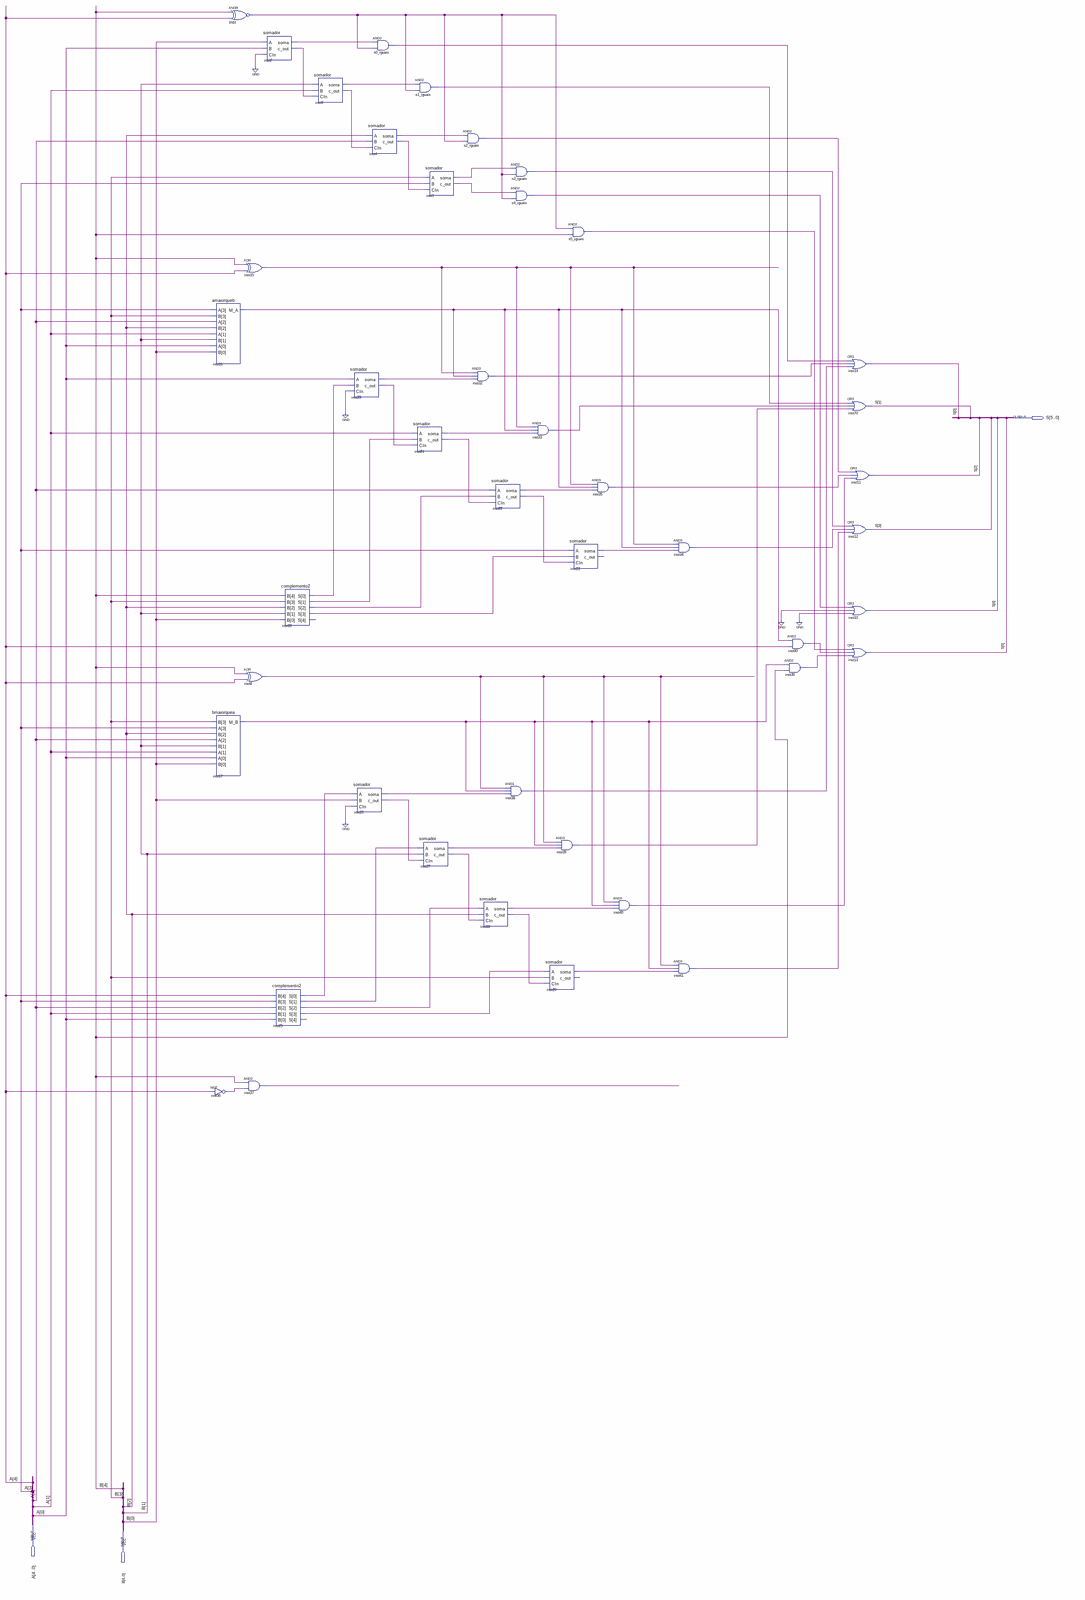
[diagram p0: schematic sheet, whole]
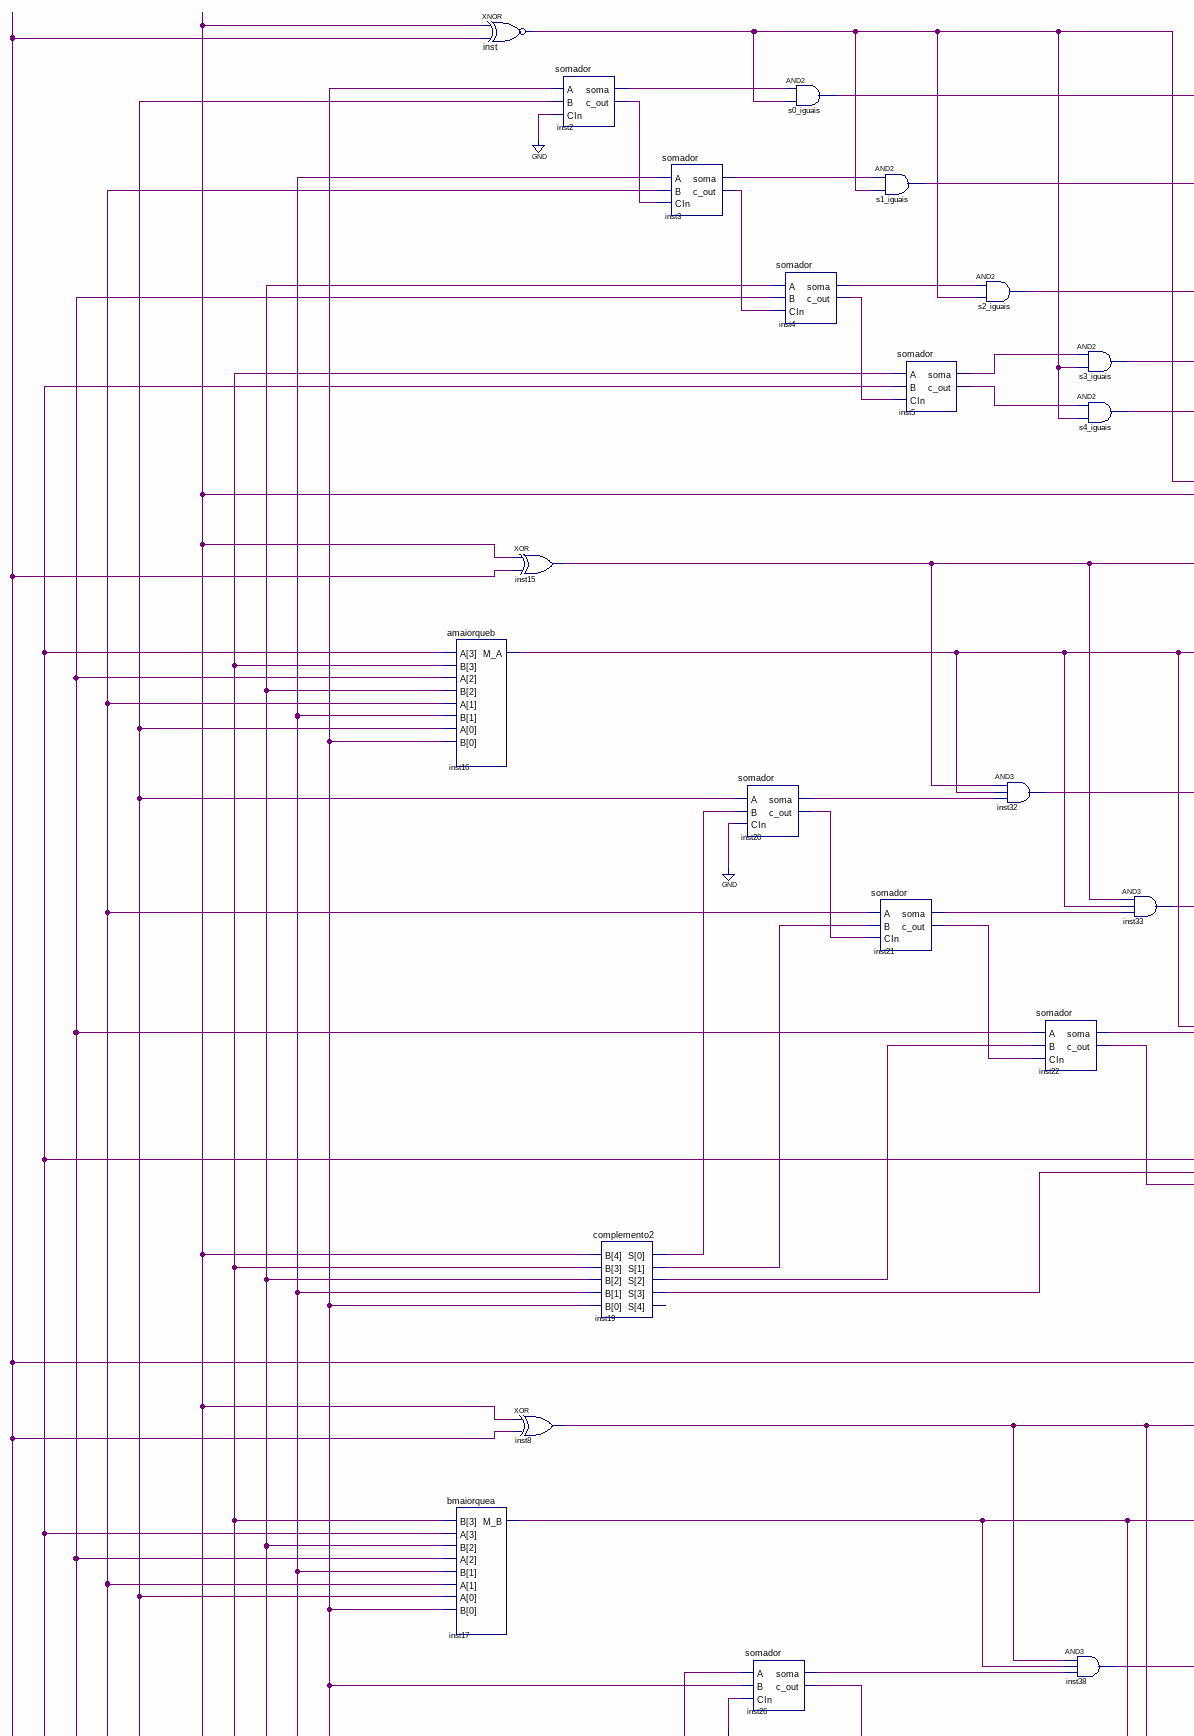
[diagram p1: schematic sheet, upper left part]
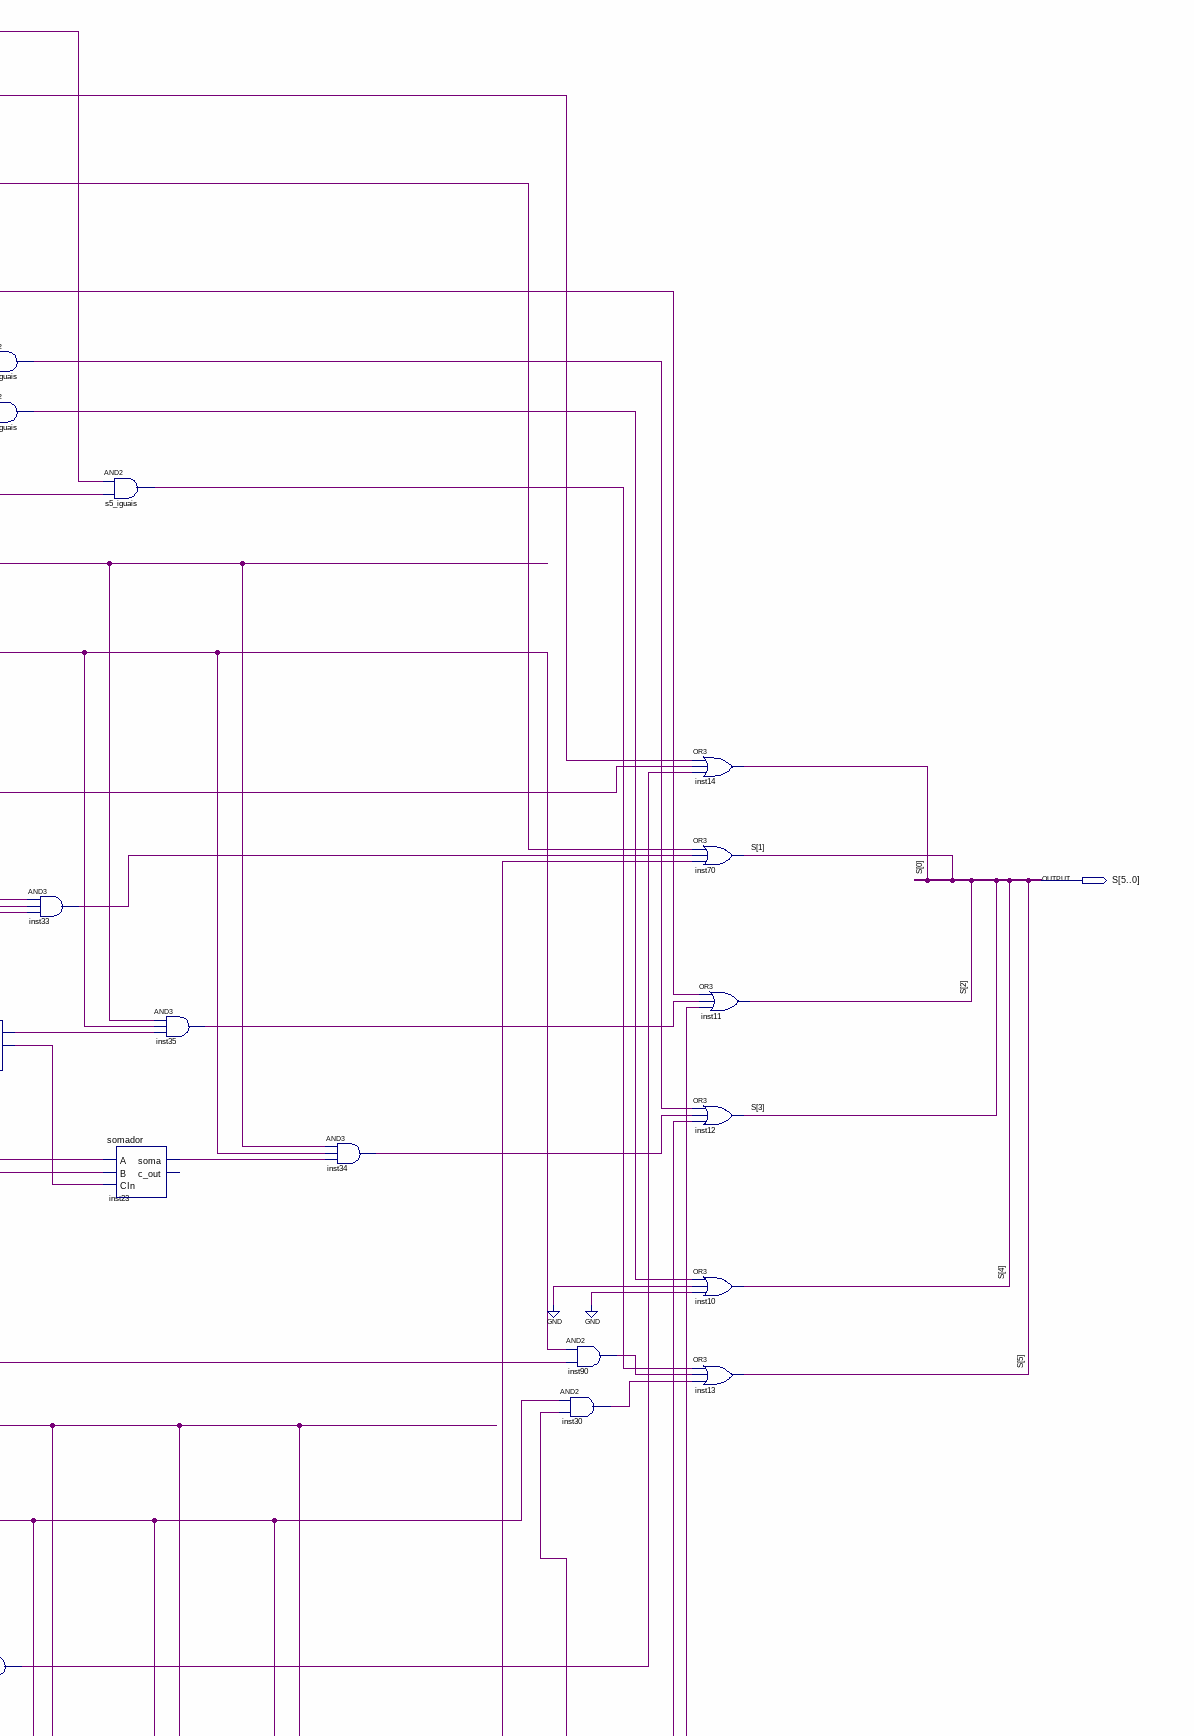
[diagram p2: schematic sheet, upper right part]
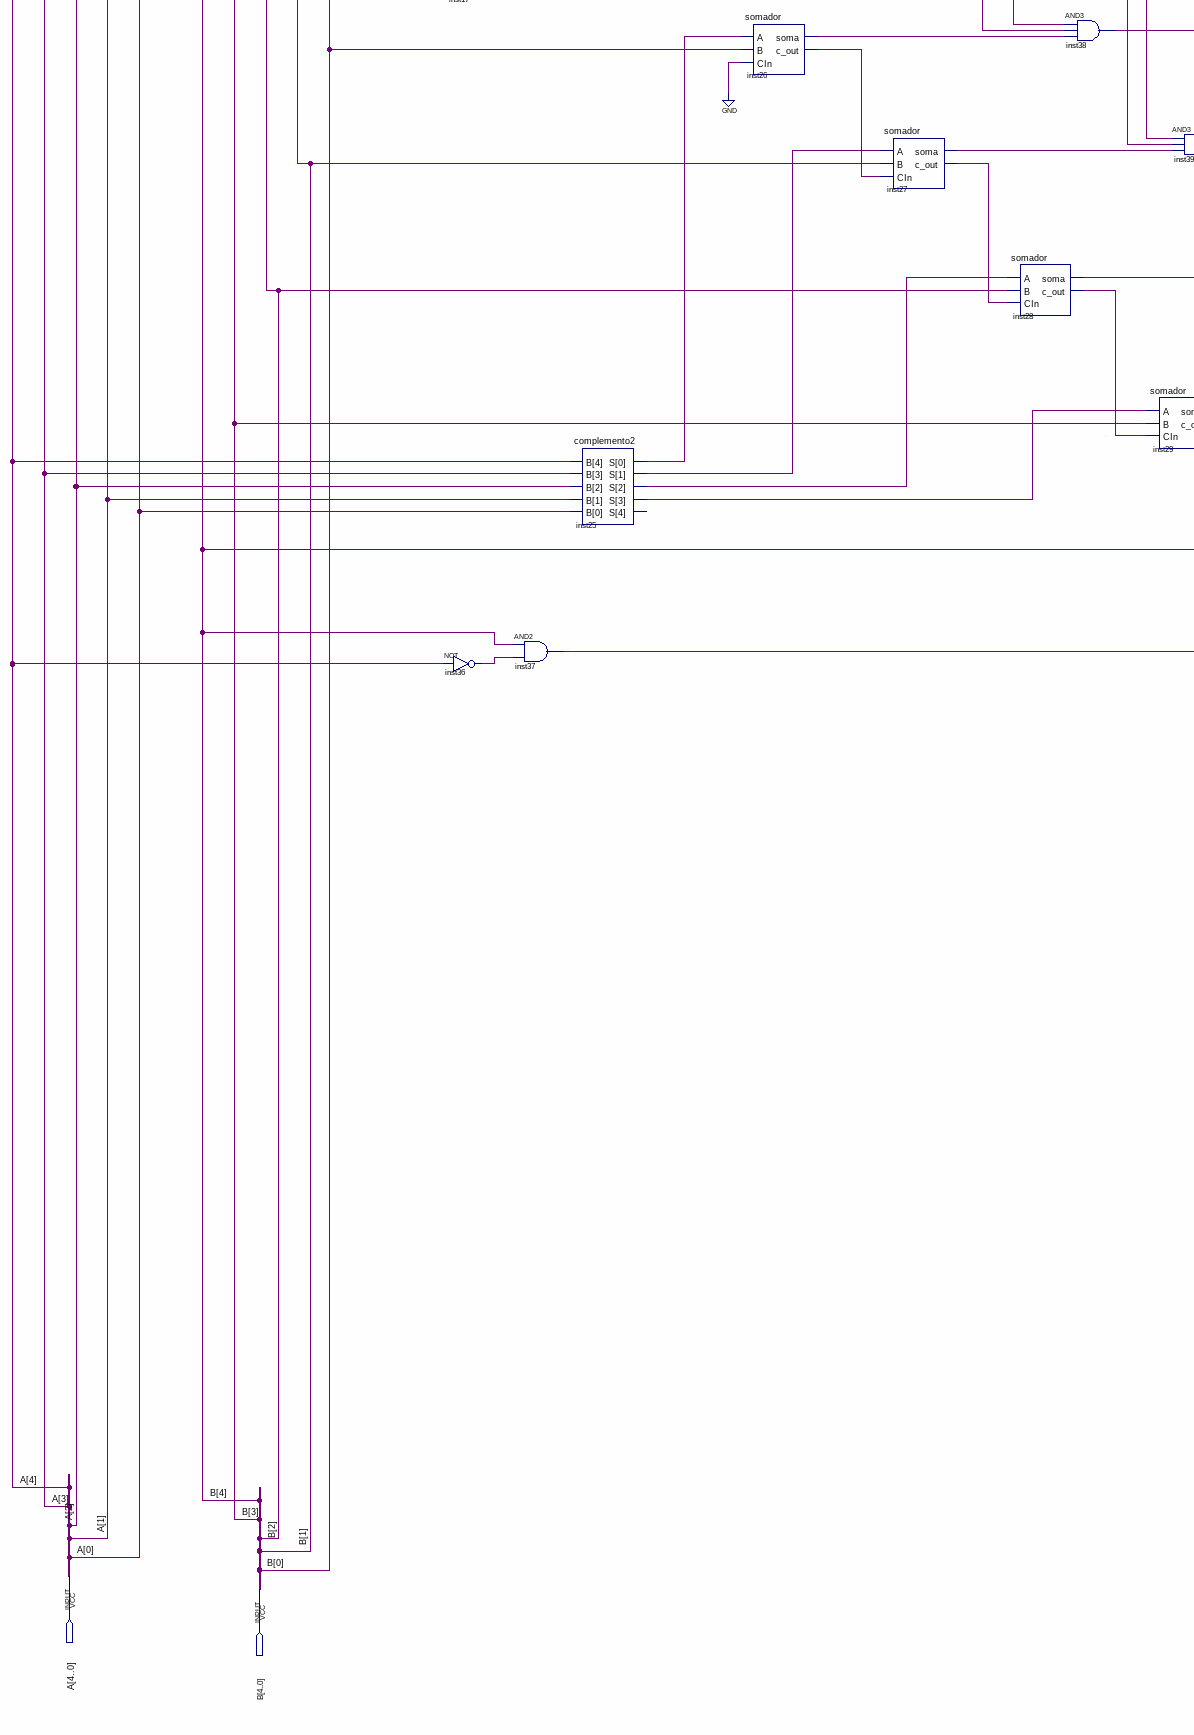
[diagram p3: schematic sheet, lower left part]
// Quartus schematic somador_completo.bdf as structural Verilog: 43 symbols, 3 pins
module somador_completo (
  input  [4:0] A,
  input  [4:0] B,
  output [5:0] S
);

  wire inst2_c_out, inst2_soma, inst3_c_out, inst3_soma, inst4_c_out, inst4_soma, inst5_c_out, inst5_soma,
       inst8_out, inst15_out, inst16_m_a, inst17_m_b, inst19_s, inst19_s_2, inst19_s_3, inst19_s_4,
       inst20_c_out, inst20_soma, inst21_c_out, inst21_soma, inst22_c_out, inst22_soma, inst23_soma,
       inst25_s, inst25_s_2, inst25_s_3, inst25_s_4, inst26_c_out, inst26_soma, inst27_c_out, inst27_soma,
       inst28_c_out, inst28_soma, inst29_soma, inst30_out, inst32_out, inst33_out, inst34_out, inst35_out,
       inst36_out, inst37_out, inst38_out, inst39_out, inst40_out, inst41_out, inst90_out, inst_out,
       s0_iguais_out, s1_iguais_out, s2_iguais_out, s3_iguais_out, s4_iguais_out, s5_iguais_out;
  wire [4:0] inst19_s_open;  // unused outputs
  wire [4:0] inst25_s_open;  // unused outputs

  xnor inst (inst_out, B[4], A[4]);
  amaiorqueb inst16 (.A(A[3:0]), .B(B[3:0]), .M_A(inst16_m_a));
  bmaiorquea inst17 (.B(B[3:0]), .A(A[3:0]), .M_B(inst17_m_b));
  not inst36 (inst36_out, A[4]);
  xor inst15 (inst15_out, B[4], A[4]);
  xor inst8 (inst8_out, B[4], A[4]);
  and inst37 (inst37_out, B[4], inst36_out);
  somador inst2 (.A(B[0]), .B(A[0]), .CIn(1'b0), .soma(inst2_soma), .c_out(inst2_c_out));
  complemento2 inst25 (.B(A), .S({inst25_s_open[4], inst25_s_4, inst25_s_3, inst25_s_2, inst25_s}));
  complemento2 inst19 (.B(B), .S({inst19_s_open[4], inst19_s_4, inst19_s_3, inst19_s_2, inst19_s}));
  somador inst3 (.A(B[1]), .B(A[1]), .CIn(inst2_c_out), .soma(inst3_soma), .c_out(inst3_c_out));
  somador inst20 (.A(A[0]), .B(inst19_s), .CIn(1'b0), .soma(inst20_soma), .c_out(inst20_c_out));
  and s0_iguais (s0_iguais_out, inst2_soma, inst_out);
  somador inst4 (.A(B[2]), .B(A[2]), .CIn(inst3_c_out), .soma(inst4_soma), .c_out(inst4_c_out));
  somador inst26 (.A(inst25_s), .B(B[0]), .CIn(1'b0), .soma(inst26_soma), .c_out(inst26_c_out));
  and s1_iguais (s1_iguais_out, inst3_soma, inst_out);
  somador inst21 (.A(A[1]), .B(inst19_s_2), .CIn(inst20_c_out), .soma(inst21_soma), .c_out(inst21_c_out));
  somador inst27 (.A(inst25_s_2), .B(B[1]), .CIn(inst26_c_out), .soma(inst27_soma), .c_out(inst27_c_out));
  somador inst5 (.A(B[3]), .B(A[3]), .CIn(inst4_c_out), .soma(inst5_soma), .c_out(inst5_c_out));
  and s2_iguais (s2_iguais_out, inst4_soma, inst_out);
  and inst32 (inst32_out, inst15_out, inst16_m_a, inst20_soma);
  somador inst22 (.A(A[2]), .B(inst19_s_3), .CIn(inst21_c_out), .soma(inst22_soma), .c_out(inst22_c_out));
  somador inst28 (.A(inst25_s_3), .B(B[2]), .CIn(inst27_c_out), .soma(inst28_soma), .c_out(inst28_c_out));
  and s3_iguais (s3_iguais_out, inst5_soma, inst_out);
  and s4_iguais (s4_iguais_out, inst5_c_out, inst_out);
  and inst38 (inst38_out, inst8_out, inst17_m_b, inst26_soma);
  and inst33 (inst33_out, inst15_out, inst16_m_a, inst21_soma);
  and inst39 (inst39_out, inst8_out, inst17_m_b, inst27_soma);
  somador inst29 (.A(inst25_s_4), .B(B[3]), .CIn(inst28_c_out), .soma(inst29_soma));  // open: c_out
  and s5_iguais (s5_iguais_out, inst_out, B[4]);
  somador inst23 (.A(A[3]), .B(inst19_s_4), .CIn(inst22_c_out), .soma(inst23_soma));  // open: c_out
  and inst35 (inst35_out, inst15_out, inst16_m_a, inst22_soma);
  and inst40 (inst40_out, inst8_out, inst17_m_b, inst28_soma);
  and inst34 (inst34_out, inst15_out, inst16_m_a, inst23_soma);
  and inst41 (inst41_out, inst8_out, inst17_m_b, inst29_soma);
  and inst90 (inst90_out, inst16_m_a, A[4]);
  and inst30 (inst30_out, inst17_m_b, B[4]);
  or inst14 (S[0], s0_iguais_out, inst32_out, inst38_out);
  or inst70 (S[1], s1_iguais_out, inst33_out, inst39_out);
  or inst11 (S[2], s2_iguais_out, inst35_out, inst40_out);
  or inst12 (S[3], s3_iguais_out, inst34_out, inst41_out);
  or inst10 (S[4], s4_iguais_out, 1'b0, 1'b0);
  or inst13 (S[5], s5_iguais_out, inst90_out, inst30_out);
endmodule
